# Altium project Common_AMC_Box.PrjPcb (part 6 of 6)

## Sheet LCD_DIsp.SchDoc: Title
size 420 x 297 mm; Author: G.Kasprowicz; CompanyName: WUT ISE; DrawnBy: G.Kasprowicz; Organization: WUT ISE; Address1: PW ISE; Address2: Nowowiejska 15/19 00-665 Warsaw; Address3: gkasprow@gmail.com; DocumentNumber: 18; Revision: 2; SheetNumber: 18; SheetTotal: 18; ModifiedBy: -; CheckedDate: -; Title2: Title 2; DivGrp: WUT ISE; Designer: G.Kasprowicz; ModifiedDate: -; ProjectName: Sensor Box
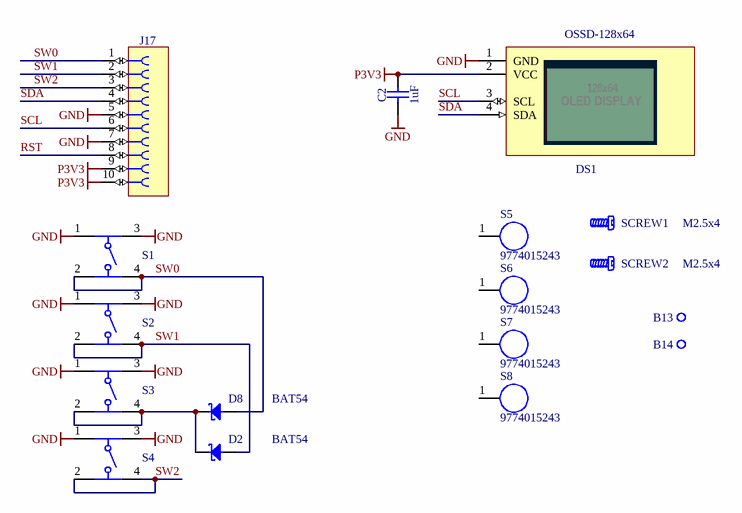
[diagram p17: LCD_DIsp.SchDoc]

### Parts
(Parts that share a designator on the sheet are numbered #1, #2 ... from top to bottom, then left to right.)
B13  Plated Hole  [MTG320_550]  (value not drawn)
B14  Plated Hole  [MTG320_550]  (value not drawn)
C2#2  1uF  [CAPC1608X87N]
D2  BAT54  [SOT95P240X130-3N]
D8  BAT54  [SOT95P240X130-3N]
DS1  OSSD-128x64  [OSSD-128x64]
J17#2  FFC  [WURTH_686 110 144 22]  (value not drawn)
S1  430152095826  [4301x20958x6_6x6x9.5]  (value not drawn)
S2  430152095826  [4301x20958x6_6x6x9.5]  (value not drawn)
S3  430152095826  [4301x20958x6_6x6x9.5]  (value not drawn)
S4  430152095826  [4301x20958x6_6x6x9.5]  (value not drawn)
S5  9774015243  [9774015243]
S6  9774015243  [9774015243]
S7  9774015243  [9774015243]
S8  9774015243  [9774015243]
SCREW1  M2.5x4  [BOSSARD_BN5687-3061587_v]
SCREW2  M2.5x4  [BOSSARD_BN5687-3061587_v]

### Nets
GND: C2#2.1 DS1.1(GND) J17#2.5 J17#2.7 S1.1 S1.3 S2.1 S2.3 S3.1 S3.3 S4.1 S4.3
P3V3: C2#2.2 DS1.2(VCC) J17#2.9 J17#2.10
RST: J17#2.8
SCL: DS1.3(SCL) J17#2.6
SDA: DS1.4(SDA) J17#2.4
SW0: D8.1(A) J17#2.1 S1.2 S1.4
SW1: D2.1(A) J17#2.2 S2.2 S2.4
SW2: J17#2.3 S4.2 S4.4
NetD2_3: D2.3(C) D8.3(C) S3.2 S3.4

Not connected (* = marked no-connect by the designer): B13 1; B14 1; S5 1; S6 1; S7 1; S8 1

### Notes on the sheet
- Project/Equipment
- Document
- Designer
- Drawn by
- Check.by
- Copyright WUT ISE 2020.
  This documentation describes Open Hardware and is licensed under the CERN OHL v.1.2. You may redistribute and modify this documentation under the terms of the CERN OHL v.1.2. (http://ohwr.org/CERNOHL). This documentation is distributed WITHOUT ANY EXPRESS OR IMPLIED WARRANTY, INCLUDING OF MERCHANTABILITY, SATISFACTORY QUALITY AND FITNESS FOR A PARTICULAR PURPOSE. Please see the CERN OHL v.1.2 for applicable conditions.
- Contact
- File
- Last Mod.
- Print Date
- Sheet
- Size
- A3
- of
- Rev
- (in symbol OLED_OSSD-128x64) 128x64; OLED DISPLAY

### Library data of the parts
B13 B14 = PLATED_HOLE3.2_PAD5.5: Single Terminal Socket; Part Description: Plated Through Hole: Hole Dia.=3.2mm Pad Dia.=5.5mm; Mounted: No; Part Number: PLATED_HOLE3.2_PAD5.5; Component Kind: Standard (No BOM); Component Type: Standard (No BOM); Pin Count: 1; Family: Plated Hole; Socket: No; SMD: No; Sense: No; Status: None; ComponentHeight: 0mm; HelpURL: Undefined; Author: CERN DEM JMW; CreateDate: 01.10.2012; LatestRevisionDate: 01.10.2012; PackageDescription: Plated Through Hole: Hole Dia.=3.2mm Pad Dia.=5.5mm
C2#2 = CC0603_1UF_16V_10%_X7R: Non-polarised capacitor; Part Description: SMD Multilayer Chip Ceramic Capacitor; Manufacturer: GENERIC; Manufacturer1 Part Number: 223878615663; Voltage: 16V; TC: X7R; Tolerance: ±10%; Part Number: CC0603_1UF_16V_10%_X7R; Component Kind: Standard; Component Type: Standard; Pin Count: 2; Value: 1uF; Status: None; Manufacturer Part Number: CC0603_1uF_16V_10%_X7R; Case: 0603; Mounted: Yes; Socket: No; SMD: Yes; Sense: No; Manufacturer1 Example: YAGEO PHYCOMP; Manufacturer1 ComponentHeight: 0.9mm; HelpURL: \\cern.ch\dfs\Applications\Altium\Datasheets\CC0603_X7R_PHYCOMP.pdf; Author: CERN DEM JLC; CreateDate: 03.12.2007; LatestRevisionDate: 17.04.2015
D2 D8 = BAT54: as D5 on sheet CPU_ETH; Part Number: BAT54; Component Kind: Standard; Component Type: Standard; Device: BAT54; PackageDescription: SOT23 3-Leads, Pitch 0.95mm - Body 1.3x2.9mm, IPC Medium Density; Manufacturer Part Number: BAT54; Pin Count: 3; Case: SOT23-3; Mounted: Yes; Socket: No; SMD: Yes; ComponentHeight: 1.30mm; HelpURL: \\cern.ch\dfs\Applications\Altium\Datasheets\BAT54.pdf; Author: CERN DEM JLC; CreateDate: 2009-09-17; LatestRevisionDate: 2010-05-27
DS1 = OLED_OSSD-128x64: 128x64 0.96" OLED display; Part Description: 128x64 1.3" OLED display; Manufacturer: Generic; Color: Blue; PressFit: No; Bonding: No; Part Number: OSSD-128x64; Component Kind: Standard; Component Type: Standard; Device: OSSD-128x64; PackageDescription: 128x64 1.3" OLED display; Manufacturer Part Number: OSSD-128x64; Pin Count: 4; Mounted: Yes; Socket: No; SMD: No; Sense: No; ComponentHeight: 2.8mm; HelpURL: \\cern.ch\dfs\Applications\Altium\Datasheets\DS_EA_DOGXL160B-7.pdf; Author: GK; CreateDate: 24.08.2011; LatestRevisionDate: 27.04.2011
J17#2 = WURTH_686 110 144 22: as J5 on sheet LCD; Part Number: WURTH_686 110 144 22; Component Kind: Standard; Component Type: Standard; Pin Count: 10; Family: FFC; Mounted: Yes; Socket: No; SMD: Yes; Sense: No; Status: None; Manufacturer Part Number: 686 110 144 22; ComponentHeight: 3.15mm; HelpURL: \\cern.ch\dfs\Applications\Altium\Datasheets\WURTH_686 110 144 22.pdf; Author: CERN DEM JMW; CreateDate: 06.08.2015; LatestRevisionDate: 06.08.2015
S1-S4 = 430152095826: WS-TASV 6x6mm Tact Switch, SMD version; Operation Force: 260g; ComponentLink1Description: Manufacturer; ComponentLink1URL: http://www.we-online.de; ComponentLink2Description: Datasheet; ComponentLink2URL: http://katalog.we-online.de/em/datasheet/4301x2xxx8x6.pdf; Part Number: 430152095826; Published Date: June 2017; Publisher: Wurth Elektronik; Life Cycle: 200000 cycles; Size: 6x6x9.5 mm
S5-S8 = WA-SMSI,  9774015243: WA-SMSI SMD Steel Spacer with internal Thread; Manufacturer: Wurth Elektronik; partNo: 9774015243; ComponentLink1Description: Manufacturer; ComponentLink1URL: http://www.we-online.de; Created by: Baojun Chen; Created Date: 20.Oct.2015; ComponentLink2Description: Datasheet; ComponentLink2URL: http://katalog.we-online.de/em/datasheet/9774015243.pdf
SCREW1 SCREW2 = BOSSARD_BN5687-3061587_v: Screw; Part Description: M2.5 L=4mm Hexalobular Socket Pan Head Screw, Fully Threaded, Stainless Steel A2; Manufacturer Part Number: BN5687 Art.3061587; PressFit: No; Part Number: BOSSARD_BN5687-3061587_v; Component Kind: Standard; Component Type: Mechanical; Pin Count: 0; PackageDescription: M2.5 L=4mm Hexalobular Socket Pan Head Screw, Fully Threaded - Stainless Steel A2; Mounted: Yes; Socket: No; SMD: No; Sense: No; Status: None; Value: M2.5x4; Manufacturer: BOSSARD; ComponentHeight: 5mm; HelpURL: \\cern.ch\dfs\Applications\Altium\Datasheets\BOSSARD_BN5687-3061587.pdf; Author: CERN DEM JLC; CreateDate: 22.08.2013; LatestRevisionDate: 22.08.2013

## Nets that join several sheets
AMC_MP: AMC_Box_Mainboard (JMP4.9), Supply (F3.2), I2C_SW (R190.2 R191.2)
GND: AMC_BOX_Backplane (29 pins), AMC (56 pins), AMC_Box_Mainboard (53 pins), Supply (32 pins), clocking (5 pins), U_AMC_Box_Mainboard/U_IO (19 pins), U_AMC_Box_Mainboard/U_IO (19 pins), U_AMC_Box_Mainboard/U_SFP (18 pins), U_AMC_Box_Mainboard/U_SFP (18 pins), I2C_SW (5 pins), Thermal_MGT (11 pins), CPU_ETH (29 pins), LCD (J5.4 J5.6), USB_Hub_AMCbox (52 pins), USB_UART (12 pins), JTAG_AMC_Box (25 pins), USB_I2C_Bridge (16 pins), U_AMC_Box_Mainboard/U_QSFP0 (49 pins), U_AMC_Box_Mainboard/U_QSFP1 (49 pins), U_AMC_Box_Mainboard/U_QSFP2 (49 pins), LCD_DIsp (12 pins)
P3V3: Supply (19 pins), clocking (FB2.1), U_AMC_Box_Mainboard/U_IO (14 pins), U_AMC_Box_Mainboard/U_IO (14 pins), U_AMC_Box_Mainboard/U_SFP (13 pins), U_AMC_Box_Mainboard/U_SFP (13 pins), I2C_SW (18 pins), Thermal_MGT (8 pins), CPU_ETH (26 pins), LCD (J5.1 J5.2), USB_Hub_AMCbox (33 pins), USB_UART (D10.3 D21.1), JTAG_AMC_Box (8 pins), USB_I2C_Bridge (9 pins), U_AMC_Box_Mainboard/U_QSFP0 (18 pins), U_AMC_Box_Mainboard/U_QSFP1 (18 pins), U_AMC_Box_Mainboard/U_QSFP2 (18 pins), LCD_DIsp (C2#2.2 DS1.2 J17#2.9 J17#2.10)
P5V0: Supply (C94.2 C97.2 L2.2 R94.2), JTAG_AMC_Box (F1.1 F2.1), USB_I2C_Bridge (C10.2 IC21.2 IC21.7)
P12V: Supply (20 pins), Thermal_MGT (6 pins)
EN_AMC_MP: Supply (R54.2 T8.1), CPU_ETH (R1#2.2 R112.1 TP31.1)
EN_AMC_PWR: Supply (R111.2 T5.1), CPU_ETH (IC20.37 TP32.1)
FANn: Thermal_MGT (IC1.5 IC9.3 R154.2), CPU_ETH (IC20.39 TP36.1)
LVDS0_N: U_AMC_Box_Mainboard/U_IO (5 pins), U_AMC_Box_Mainboard/U_IO (5 pins)
LVDS0_P: U_AMC_Box_Mainboard/U_IO (5 pins), U_AMC_Box_Mainboard/U_IO (5 pins)
LVDS1_N: U_AMC_Box_Mainboard/U_IO (5 pins), U_AMC_Box_Mainboard/U_IO (5 pins)
LVDS1_P: U_AMC_Box_Mainboard/U_IO (5 pins), U_AMC_Box_Mainboard/U_IO (5 pins)
LVDS2_N: U_AMC_Box_Mainboard/U_IO (D4_U_AMC_Box_Mainboard_U_IO#1.1 IC11_U_AMC_Box_Mainboard_U_IO#1.3 R26_U_AMC_Box_Mainboard_U_IO#1.1 R43_U_AMC_Box_Mainboard_U_IO#1.2), U_AMC_Box_Mainboard/U_IO (D4_U_AMC_Box_Mainboard_U_IO#2.1 IC11_U_AMC_Box_Mainboard_U_IO#2.3 R26_U_AMC_Box_Mainboard_U_IO#2.1 R43_U_AMC_Box_Mainboard_U_IO#2.2)
LVDS2_P: U_AMC_Box_Mainboard/U_IO (D4_U_AMC_Box_Mainboard_U_IO#1.6 IC11_U_AMC_Box_Mainboard_U_IO#1.4 R26_U_AMC_Box_Mainboard_U_IO#1.2 R42_U_AMC_Box_Mainboard_U_IO#1.2), U_AMC_Box_Mainboard/U_IO (D4_U_AMC_Box_Mainboard_U_IO#2.6 IC11_U_AMC_Box_Mainboard_U_IO#2.4 R26_U_AMC_Box_Mainboard_U_IO#2.2 R42_U_AMC_Box_Mainboard_U_IO#2.2)
LVDS3_N: U_AMC_Box_Mainboard/U_IO (D4_U_AMC_Box_Mainboard_U_IO#1.3 IC13_U_AMC_Box_Mainboard_U_IO#1.3 R15_U_AMC_Box_Mainboard_U_IO#1.2 R31_U_AMC_Box_Mainboard_U_IO#1.1), U_AMC_Box_Mainboard/U_IO (D4_U_AMC_Box_Mainboard_U_IO#2.3 IC13_U_AMC_Box_Mainboard_U_IO#2.3 R15_U_AMC_Box_Mainboard_U_IO#2.2 R31_U_AMC_Box_Mainboard_U_IO#2.1)
LVDS3_P: U_AMC_Box_Mainboard/U_IO (D4_U_AMC_Box_Mainboard_U_IO#1.4 IC13_U_AMC_Box_Mainboard_U_IO#1.4 R14_U_AMC_Box_Mainboard_U_IO#1.2 R31_U_AMC_Box_Mainboard_U_IO#1.2), U_AMC_Box_Mainboard/U_IO (D4_U_AMC_Box_Mainboard_U_IO#2.4 IC13_U_AMC_Box_Mainboard_U_IO#2.4 R14_U_AMC_Box_Mainboard_U_IO#2.2 R31_U_AMC_Box_Mainboard_U_IO#2.2)
NetIC7_2: CPU_ETH (IC20.13), USB_UART (IC7.2 IC7.3)
NetIC7_9: CPU_ETH (IC20.12), USB_UART (IC7.9 IC7.10)
NetIC16_24: I2C_SW (IC16.24 R197.1), CPU_ETH (IC20.36)
NetIC17_1: CPU_ETH (IC20.1), JTAG_AMC_Box (IC17.1 R69.2)
NetIC20_0: U_AMC_Box_Mainboard/U_SFP (R8_U_AMC_Box_Mainboard_U_SFP#1.1), U_AMC_Box_Mainboard/U_SFP (R8_U_AMC_Box_Mainboard_U_SFP#2.1), CPU_ETH (IC20.0 R9.2), U_AMC_Box_Mainboard/U_QSFP0 (R10_U_QSFP0.1), U_AMC_Box_Mainboard/U_QSFP1 (R10_U_QSFP1.1), U_AMC_Box_Mainboard/U_QSFP2 (R10_U_QSFP2.1)
NetR85_2: I2C_SW (SW3.2 SW4.2), USB_I2C_Bridge (R85.2)
NetR107_2: I2C_SW (SW3.1 SW4.1), USB_I2C_Bridge (R107.2)
OVERn: Thermal_MGT (IC1.14 IC9.12 R153.2), CPU_ETH (IC20.3 TP37.1)
QSFP_SCL: U_AMC_Box_Mainboard/U_SFP (CON20_U_AMC_Box_Mainboard_U_SFP#1.5 IC3_U_AMC_Box_Mainboard_U_SFP#1.14), U_AMC_Box_Mainboard/U_SFP (CON20_U_AMC_Box_Mainboard_U_SFP#2.5 IC3_U_AMC_Box_Mainboard_U_SFP#2.14), Thermal_MGT (IC1.16 IC9.13), LCD (J5.5 TP8.1), U_AMC_Box_Mainboard/U_QSFP0 (IC14_U_QSFP0.14 J1_U_QSFP0.11), U_AMC_Box_Mainboard/U_QSFP1 (IC14_U_QSFP1.14 J1_U_QSFP1.11), U_AMC_Box_Mainboard/U_QSFP2 (IC14_U_QSFP2.14 J1_U_QSFP2.11)
QSFP_SDA: U_AMC_Box_Mainboard/U_SFP (CON20_U_AMC_Box_Mainboard_U_SFP#1.4 IC3_U_AMC_Box_Mainboard_U_SFP#1.15), U_AMC_Box_Mainboard/U_SFP (CON20_U_AMC_Box_Mainboard_U_SFP#2.4 IC3_U_AMC_Box_Mainboard_U_SFP#2.15), Thermal_MGT (IC1.15 IC9.14), LCD (J5.7 TP7.1), U_AMC_Box_Mainboard/U_QSFP0 (IC14_U_QSFP0.15 J1_U_QSFP0.12), U_AMC_Box_Mainboard/U_QSFP1 (IC14_U_QSFP1.15 J1_U_QSFP1.12), U_AMC_Box_Mainboard/U_QSFP2 (IC14_U_QSFP2.15 J1_U_QSFP2.12)
RX_N: U_AMC_Box_Mainboard/U_SFP (CON20_U_AMC_Box_Mainboard_U_SFP#1.12), U_AMC_Box_Mainboard/U_SFP (CON20_U_AMC_Box_Mainboard_U_SFP#2.12)
RX_P: U_AMC_Box_Mainboard/U_SFP (CON20_U_AMC_Box_Mainboard_U_SFP#1.13), U_AMC_Box_Mainboard/U_SFP (CON20_U_AMC_Box_Mainboard_U_SFP#2.13)
SOM_TCK: CPU_ETH (IC20.21), JTAG_AMC_Box (IC17.11)
SOM_TDI: CPU_ETH (IC20.20), JTAG_AMC_Box (IC17.2)
SOM_TDO: CPU_ETH (IC20.19), JTAG_AMC_Box (IC17.5)
SOM_TMS: CPU_ETH (IC20.11), JTAG_AMC_Box (IC17.14)
SOM_TRST: CPU_ETH (IC20.2), JTAG_AMC_Box (D13.3)
SW0: CPU_ETH (IC20.15 R63.2), LCD (J5.10)
SW1: CPU_ETH (IC20.16 R64.2), LCD (J5.9)
SW2: CPU_ETH (IC20.17 R65.2), LCD (J5.8)
THERMn: Thermal_MGT (IC1.6 IC9.4 R152.2), CPU_ETH (IC20.40 TP39.1)
TX_N: U_AMC_Box_Mainboard/U_SFP (CON20_U_AMC_Box_Mainboard_U_SFP#1.19), U_AMC_Box_Mainboard/U_SFP (CON20_U_AMC_Box_Mainboard_U_SFP#2.19)
TX_P: U_AMC_Box_Mainboard/U_SFP (CON20_U_AMC_Box_Mainboard_U_SFP#1.18), U_AMC_Box_Mainboard/U_SFP (CON20_U_AMC_Box_Mainboard_U_SFP#2.18)
USB0_N: CPU_ETH (IC20.D-), USB_Hub_AMCbox (IC8.30 IC12.3)
USB0_P: CPU_ETH (IC20.D+), USB_Hub_AMCbox (IC8.31 IC12.2)
USB1_N: USB_Hub_AMCbox (IC8.1 IC12.5), JTAG_AMC_Box (PCBM1.12)
USB1_P: USB_Hub_AMCbox (IC8.2 IC12.6), JTAG_AMC_Box (PCBM1.13)
USB2_N: USB_Hub_AMCbox (IC8.3 IC12.9), JTAG_AMC_Box (J19.2)
USB2_P: USB_Hub_AMCbox (IC8.4 IC12.8), JTAG_AMC_Box (J19.3)
USB3_N: USB_Hub_AMCbox (IC8.6 IC12.11), JTAG_AMC_Box (J7.2)
USB3_P: USB_Hub_AMCbox (IC8.7 IC12.12), JTAG_AMC_Box (J7.3)